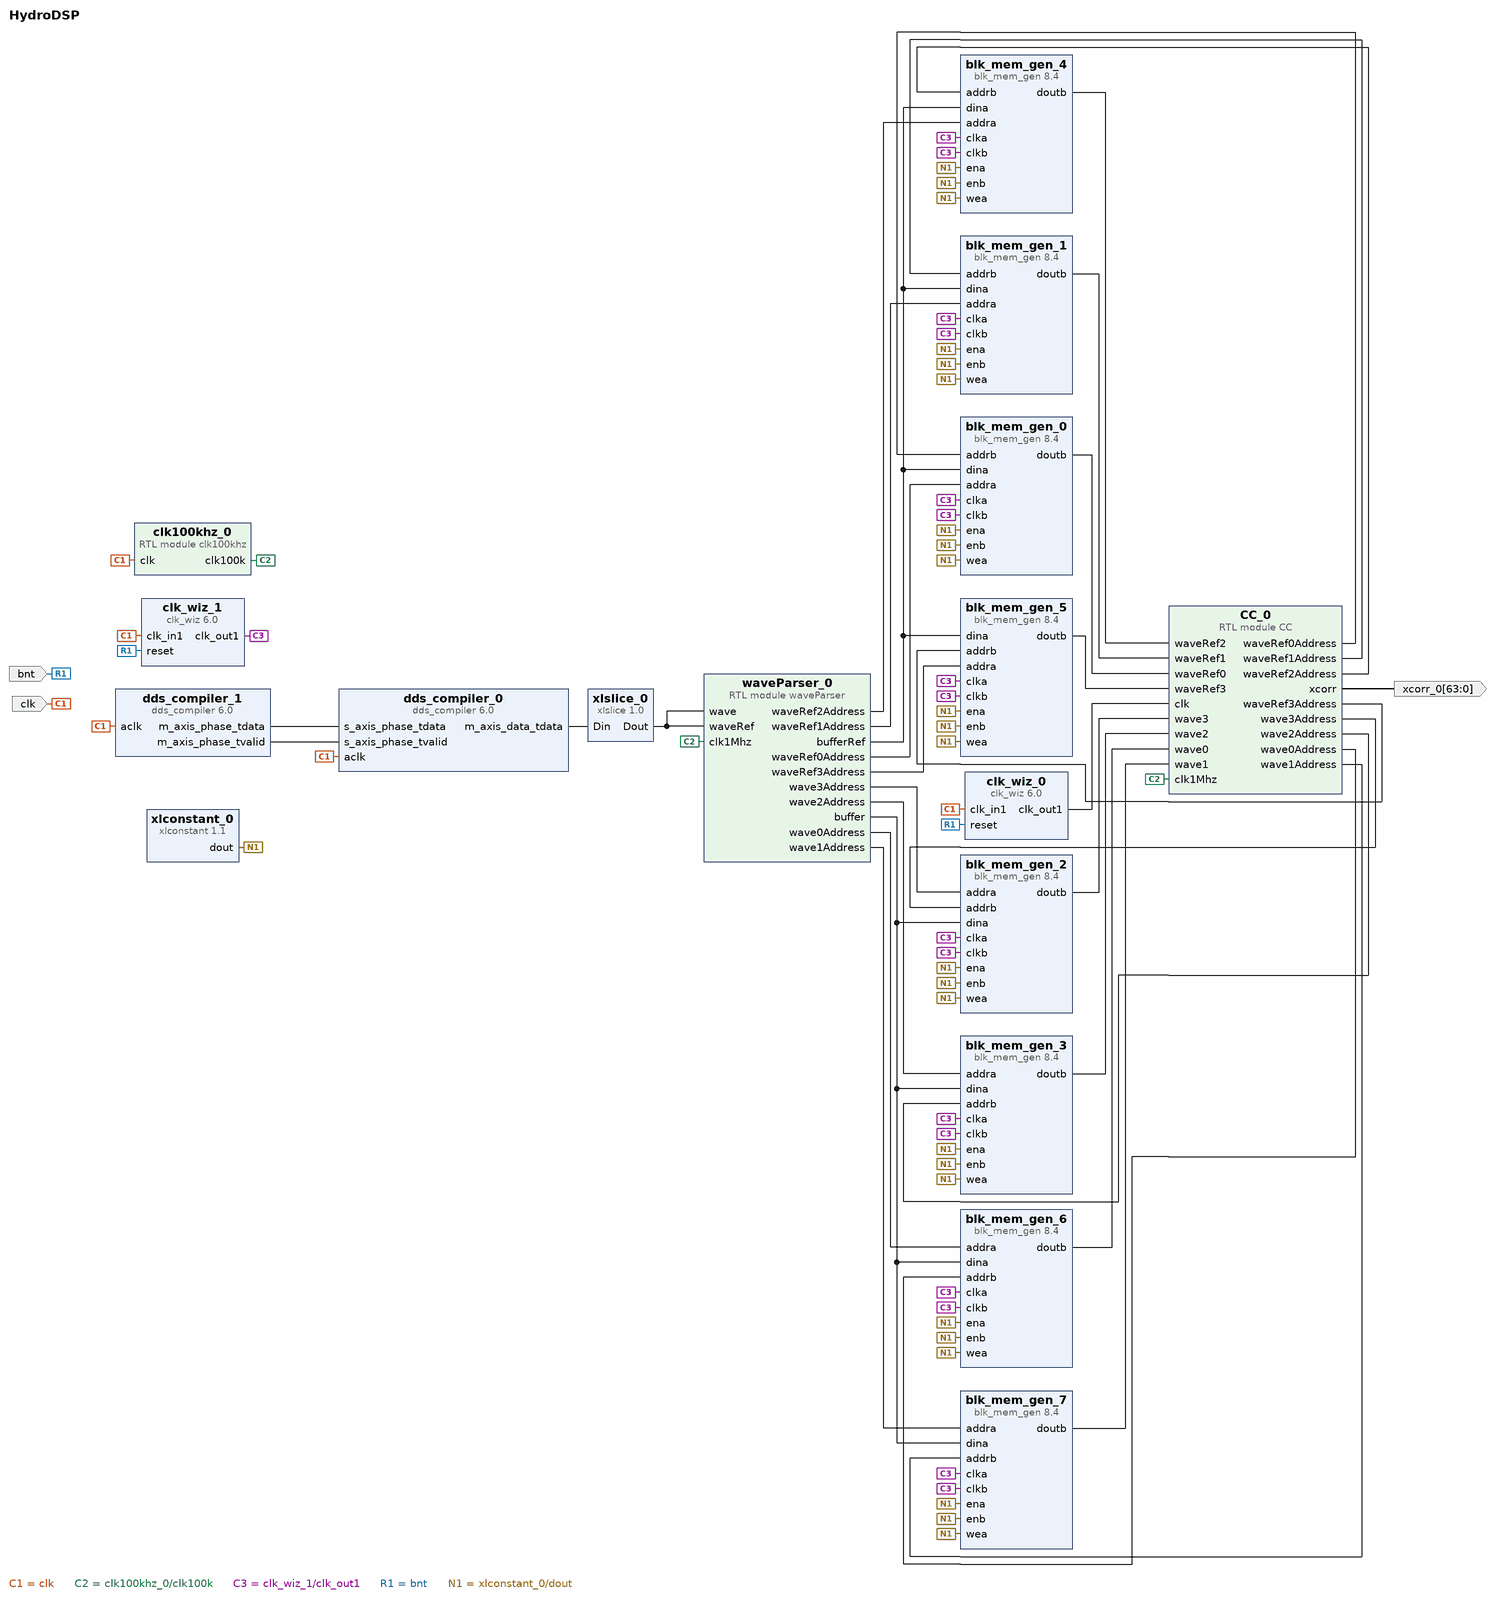
[diagram p0: block diagram of the top level]
# Vivado block design HydroDSP, xc7s25csga225-1, Vivado 2023.1
create_bd_design HydroDSP

create_bd_port -dir I -type rst bnt
set_property -dict {CONFIG.POLARITY ACTIVE_HIGH} [get_bd_ports bnt]
create_bd_port -dir I -type clk clk
create_bd_port -dir O -from 63 -to 0 xcorr_0

create_bd_cell -type ip -vlnv xilinx.com:ip:dds_compiler:6.0 dds_compiler_0
set_property -dict [list \
  CONFIG.DATA_Has_TLAST Not_Required \
  CONFIG.DDS_Clock_Rate 100 \
  CONFIG.Frequency_Resolution 0.4 \
  CONFIG.Has_Phase_Out false \
  CONFIG.Has_TREADY true \
  CONFIG.Latency 8 \
  CONFIG.M_DATA_Has_TUSER Not_Required \
  CONFIG.Mode_of_Operation Standard \
  CONFIG.Noise_Shaping None \
  CONFIG.OUTPUT_FORM Twos_Complement \
  CONFIG.Output_Frequency1 0 \
  CONFIG.Output_Selection Sine \
  CONFIG.Output_Width 12 \
  CONFIG.PINC1 0 \
  CONFIG.Parameter_Entry Hardware_Parameters \
  CONFIG.PartsPresent SIN_COS_LUT_only \
  CONFIG.Phase_Width 12 \
  CONFIG.S_PHASE_Has_TUSER Not_Required \
] [get_bd_cells dds_compiler_0]
create_bd_cell -type ip -vlnv xilinx.com:ip:dds_compiler:6.0 dds_compiler_1
set_property -dict [list \
  CONFIG.DATA_Has_TLAST Not_Required \
  CONFIG.Latency 1 \
  CONFIG.M_DATA_Has_TUSER Not_Required \
  CONFIG.Noise_Shaping None \
  CONFIG.Output_Frequency1 0 \
  CONFIG.Output_Width 3 \
  CONFIG.PINC1 1 \
  CONFIG.Parameter_Entry Hardware_Parameters \
  CONFIG.PartsPresent Phase_Generator_only \
  CONFIG.Phase_Width 12 \
  CONFIG.S_PHASE_Has_TUSER Not_Required \
] [get_bd_cells dds_compiler_1]
create_bd_cell -type ip -vlnv xilinx.com:ip:clk_wiz:6.0 clk_wiz_0
set_property -dict [list \
  CONFIG.CLKOUT1_JITTER 114.829 \
  CONFIG.CLKOUT1_REQUESTED_OUT_FREQ 200.000 \
  CONFIG.MMCM_CLKOUT0_DIVIDE_F 5.000 \
  CONFIG.RESET_BOARD_INTERFACE reset \
  CONFIG.USE_BOARD_FLOW true \
] [get_bd_cells clk_wiz_0]
create_bd_cell -type module -reference clk100khz clk100khz_0
create_bd_cell -type ip -vlnv xilinx.com:ip:blk_mem_gen:8.4 blk_mem_gen_0
set_property -dict [list \
  CONFIG.Memory_Type True_Dual_Port_RAM \
  CONFIG.Write_Depth_A 10001 \
  CONFIG.Write_Width_A 12 \
  CONFIG.use_bram_block Stand_Alone \
] [get_bd_cells blk_mem_gen_0]
create_bd_cell -type ip -vlnv xilinx.com:ip:blk_mem_gen:8.4 blk_mem_gen_1
set_property -dict [list \
  CONFIG.Memory_Type True_Dual_Port_RAM \
  CONFIG.Write_Depth_A 10001 \
  CONFIG.Write_Width_A 12 \
  CONFIG.use_bram_block Stand_Alone \
] [get_bd_cells blk_mem_gen_1]
create_bd_cell -type ip -vlnv xilinx.com:ip:blk_mem_gen:8.4 blk_mem_gen_2
set_property -dict [list \
  CONFIG.Memory_Type True_Dual_Port_RAM \
  CONFIG.Write_Depth_A 2501 \
  CONFIG.Write_Width_A 12 \
  CONFIG.use_bram_block Stand_Alone \
] [get_bd_cells blk_mem_gen_2]
create_bd_cell -type ip -vlnv xilinx.com:ip:blk_mem_gen:8.4 blk_mem_gen_3
set_property -dict [list \
  CONFIG.Memory_Type True_Dual_Port_RAM \
  CONFIG.Write_Depth_A 2501 \
  CONFIG.Write_Width_A 12 \
  CONFIG.use_bram_block Stand_Alone \
] [get_bd_cells blk_mem_gen_3]
create_bd_cell -type ip -vlnv xilinx.com:ip:blk_mem_gen:8.4 blk_mem_gen_4
set_property -dict [list \
  CONFIG.Memory_Type True_Dual_Port_RAM \
  CONFIG.Write_Depth_A 10001 \
  CONFIG.Write_Width_A 12 \
  CONFIG.use_bram_block Stand_Alone \
] [get_bd_cells blk_mem_gen_4]
create_bd_cell -type ip -vlnv xilinx.com:ip:blk_mem_gen:8.4 blk_mem_gen_5
set_property -dict [list \
  CONFIG.Memory_Type True_Dual_Port_RAM \
  CONFIG.Operating_Mode_B READ_FIRST \
  CONFIG.Register_PortB_Output_of_Memory_Core true \
  CONFIG.Write_Depth_A 10001 \
  CONFIG.Write_Width_A 12 \
  CONFIG.use_bram_block Stand_Alone \
] [get_bd_cells blk_mem_gen_5]
create_bd_cell -type ip -vlnv xilinx.com:ip:blk_mem_gen:8.4 blk_mem_gen_6
set_property -dict [list \
  CONFIG.Memory_Type True_Dual_Port_RAM \
  CONFIG.Write_Depth_A 2501 \
  CONFIG.Write_Width_A 12 \
  CONFIG.use_bram_block Stand_Alone \
] [get_bd_cells blk_mem_gen_6]
create_bd_cell -type ip -vlnv xilinx.com:ip:blk_mem_gen:8.4 blk_mem_gen_7
set_property -dict [list \
  CONFIG.Memory_Type True_Dual_Port_RAM \
  CONFIG.Write_Depth_A 2501 \
  CONFIG.Write_Width_A 12 \
  CONFIG.use_bram_block Stand_Alone \
] [get_bd_cells blk_mem_gen_7]
create_bd_cell -type ip -vlnv xilinx.com:ip:xlconstant:1.1 xlconstant_0
create_bd_cell -type ip -vlnv xilinx.com:ip:clk_wiz:6.0 clk_wiz_1
set_property -dict [list \
  CONFIG.CLKOUT1_JITTER 101.114 \
  CONFIG.CLKOUT1_REQUESTED_OUT_FREQ 400 \
  CONFIG.MMCM_CLKOUT0_DIVIDE_F 2.500 \
  CONFIG.RESET_BOARD_INTERFACE reset \
  CONFIG.USE_BOARD_FLOW true \
] [get_bd_cells clk_wiz_1]
create_bd_cell -type ip -vlnv xilinx.com:ip:xlslice:1.0 xlslice_0
set_property -dict {CONFIG.DIN_FROM 11 CONFIG.DIN_WIDTH 16} [get_bd_cells xlslice_0]
create_bd_cell -type module -reference waveParser waveParser_0
create_bd_cell -type module -reference CC CC_0

# ---- connections ----

connect_bd_net [get_bd_pins CC_0/wave0Address] [get_bd_pins blk_mem_gen_6/addrb]
connect_bd_net [get_bd_pins CC_0/wave1Address] [get_bd_pins blk_mem_gen_7/addrb]
connect_bd_net [get_bd_pins CC_0/wave2Address] [get_bd_pins blk_mem_gen_3/addrb]
connect_bd_net [get_bd_pins CC_0/wave3Address] [get_bd_pins blk_mem_gen_2/addrb]
connect_bd_net [get_bd_pins CC_0/waveRef0Address] [get_bd_pins blk_mem_gen_0/addrb]
connect_bd_net [get_bd_pins CC_0/waveRef1Address] [get_bd_pins blk_mem_gen_1/addrb]
connect_bd_net [get_bd_pins CC_0/waveRef2Address] [get_bd_pins blk_mem_gen_4/addrb]
connect_bd_net [get_bd_pins CC_0/waveRef3Address] [get_bd_pins blk_mem_gen_5/addrb]
connect_bd_net [get_bd_pins CC_0/xcorr] [get_bd_ports xcorr_0]
connect_bd_net [get_bd_ports clk] \
  [get_bd_pins dds_compiler_0/aclk] [get_bd_pins dds_compiler_1/aclk] [get_bd_pins clk_wiz_0/clk_in1] \
  [get_bd_pins clk100khz_0/clk] [get_bd_pins clk_wiz_1/clk_in1]
connect_bd_net [get_bd_pins blk_mem_gen_0/doutb] [get_bd_pins CC_0/waveRef0]
connect_bd_net [get_bd_pins blk_mem_gen_1/doutb] [get_bd_pins CC_0/waveRef1]
connect_bd_net [get_bd_pins blk_mem_gen_2/doutb] [get_bd_pins CC_0/wave3]
connect_bd_net [get_bd_pins blk_mem_gen_3/doutb] [get_bd_pins CC_0/wave2]
connect_bd_net [get_bd_pins blk_mem_gen_4/doutb] [get_bd_pins CC_0/waveRef2]
connect_bd_net [get_bd_pins blk_mem_gen_5/doutb] [get_bd_pins CC_0/waveRef3]
connect_bd_net [get_bd_pins blk_mem_gen_6/doutb] [get_bd_pins CC_0/wave0]
connect_bd_net [get_bd_pins blk_mem_gen_7/doutb] [get_bd_pins CC_0/wave1]
connect_bd_net [get_bd_pins clk100khz_0/clk100k] [get_bd_pins waveParser_0/clk1Mhz] [get_bd_pins CC_0/clk1Mhz]
connect_bd_net [get_bd_pins clk_wiz_0/clk_out1] [get_bd_pins CC_0/clk]
connect_bd_net [get_bd_pins clk_wiz_1/clk_out1] \
  [get_bd_pins blk_mem_gen_0/clka] [get_bd_pins blk_mem_gen_0/clkb] [get_bd_pins blk_mem_gen_1/clka] \
  [get_bd_pins blk_mem_gen_1/clkb] [get_bd_pins blk_mem_gen_2/clkb] [get_bd_pins blk_mem_gen_2/clka] \
  [get_bd_pins blk_mem_gen_3/clkb] [get_bd_pins blk_mem_gen_3/clka] [get_bd_pins blk_mem_gen_7/clkb] \
  [get_bd_pins blk_mem_gen_7/clka] [get_bd_pins blk_mem_gen_6/clkb] [get_bd_pins blk_mem_gen_6/clka] \
  [get_bd_pins blk_mem_gen_5/clkb] [get_bd_pins blk_mem_gen_5/clka] [get_bd_pins blk_mem_gen_4/clkb] \
  [get_bd_pins blk_mem_gen_4/clka]
connect_bd_net [get_bd_pins dds_compiler_0/m_axis_data_tdata] [get_bd_pins xlslice_0/Din]
connect_bd_net [get_bd_pins dds_compiler_1/m_axis_phase_tdata] [get_bd_pins dds_compiler_0/s_axis_phase_tdata]
connect_bd_net [get_bd_pins dds_compiler_1/m_axis_phase_tvalid] [get_bd_pins dds_compiler_0/s_axis_phase_tvalid]
connect_bd_net -net reset_1 [get_bd_ports bnt] [get_bd_pins clk_wiz_0/reset] [get_bd_pins clk_wiz_1/reset]
connect_bd_net [get_bd_pins waveParser_0/buffer] \
  [get_bd_pins blk_mem_gen_6/dina] [get_bd_pins blk_mem_gen_7/dina] [get_bd_pins blk_mem_gen_3/dina] \
  [get_bd_pins blk_mem_gen_2/dina]
connect_bd_net [get_bd_pins waveParser_0/bufferRef] \
  [get_bd_pins blk_mem_gen_0/dina] [get_bd_pins blk_mem_gen_1/dina] [get_bd_pins blk_mem_gen_4/dina] \
  [get_bd_pins blk_mem_gen_5/dina]
connect_bd_net [get_bd_pins waveParser_0/wave0Address] [get_bd_pins blk_mem_gen_6/addra]
connect_bd_net [get_bd_pins waveParser_0/wave1Address] [get_bd_pins blk_mem_gen_7/addra]
connect_bd_net [get_bd_pins waveParser_0/wave2Address] [get_bd_pins blk_mem_gen_3/addra]
connect_bd_net [get_bd_pins waveParser_0/wave3Address] [get_bd_pins blk_mem_gen_2/addra]
connect_bd_net [get_bd_pins waveParser_0/waveRef0Address] [get_bd_pins blk_mem_gen_0/addra]
connect_bd_net [get_bd_pins waveParser_0/waveRef1Address] [get_bd_pins blk_mem_gen_1/addra]
connect_bd_net [get_bd_pins waveParser_0/waveRef2Address] [get_bd_pins blk_mem_gen_4/addra]
connect_bd_net [get_bd_pins waveParser_0/waveRef3Address] [get_bd_pins blk_mem_gen_5/addra]
connect_bd_net [get_bd_pins xlconstant_0/dout] \
  [get_bd_pins blk_mem_gen_0/enb] [get_bd_pins blk_mem_gen_0/ena] [get_bd_pins blk_mem_gen_0/wea] \
  [get_bd_pins blk_mem_gen_1/wea] [get_bd_pins blk_mem_gen_1/ena] [get_bd_pins blk_mem_gen_1/enb] \
  [get_bd_pins blk_mem_gen_2/wea] [get_bd_pins blk_mem_gen_2/ena] [get_bd_pins blk_mem_gen_6/ena] \
  [get_bd_pins blk_mem_gen_6/wea] [get_bd_pins blk_mem_gen_6/enb] [get_bd_pins blk_mem_gen_4/enb] \
  [get_bd_pins blk_mem_gen_4/ena] [get_bd_pins blk_mem_gen_4/wea] [get_bd_pins blk_mem_gen_5/wea] \
  [get_bd_pins blk_mem_gen_5/ena] [get_bd_pins blk_mem_gen_5/enb] [get_bd_pins blk_mem_gen_7/wea] \
  [get_bd_pins blk_mem_gen_7/ena] [get_bd_pins blk_mem_gen_7/enb] [get_bd_pins blk_mem_gen_3/ena] \
  [get_bd_pins blk_mem_gen_3/wea] [get_bd_pins blk_mem_gen_3/enb] [get_bd_pins blk_mem_gen_2/enb]
connect_bd_net [get_bd_pins xlslice_0/Dout] [get_bd_pins waveParser_0/waveRef] [get_bd_pins waveParser_0/wave]

validate_bd_design
save_bd_design
